# Altium schematic sheet Sheet1.SchDoc
size A4
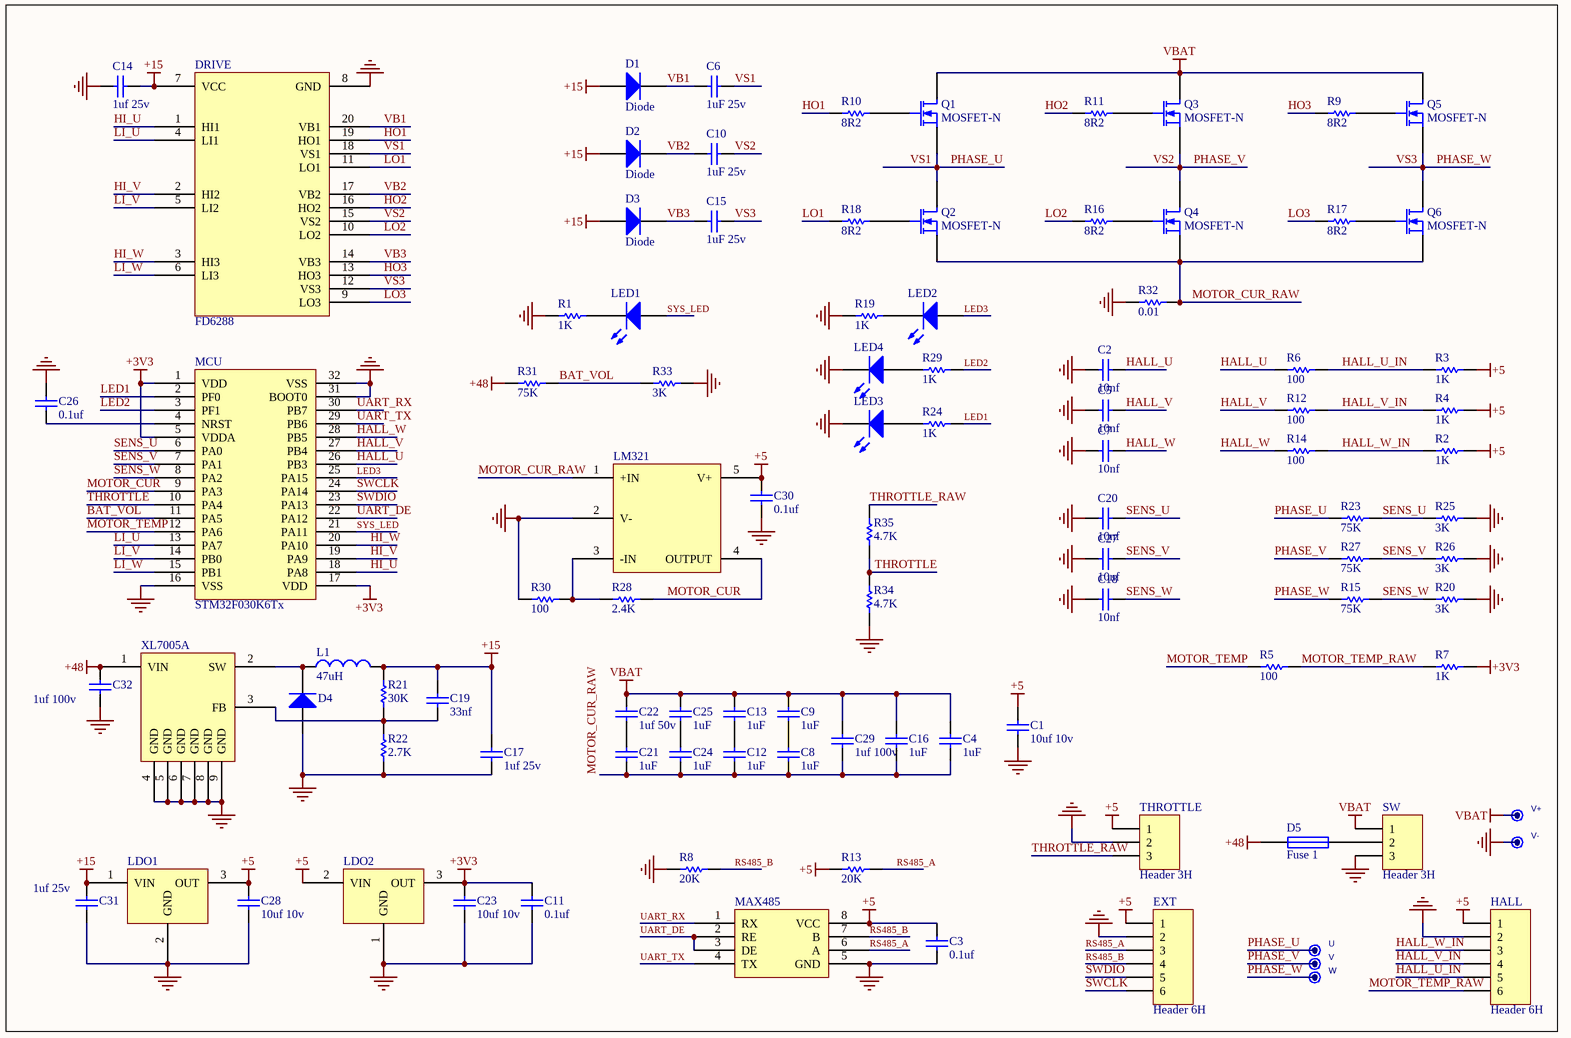
[diagram p0: Sheet1.SchDoc]

## Parts
C1  value 10uf 10v  [0603]  (hidden comment: Cap)
C2  value 10nf  [0603]  (hidden comment: Cap)
C3  value 0.1uf  [0603]  (hidden comment: Cap)
C4  value 1uF  [0603]  (hidden comment: Cap)
C5  value 10nf  [0603]  (hidden comment: Cap)
C6  value 1uF 25v  [0603]  (hidden comment: Cap)
C7  value 10nf  [0603]  (hidden comment: Cap)
C8  value 1uF  [1206]  (hidden comment: Cap)
C9  value 1uF  [1206]  (hidden comment: Cap)
C10  value 1uF 25v  [0603]  (hidden comment: Cap)
C11  value 0.1uf  [0603]  (hidden comment: Cap)
C12  value 1uF  [1206]  (hidden comment: Cap)
C13  value 1uF  [1206]  (hidden comment: Cap)
C14  value 1uf 25v  [0603]  (hidden comment: Cap)
C15  value 1uF 25v  [0603]  (hidden comment: Cap)
C16  value 1uF  [0603]  (hidden comment: Cap)
C17  value 1uf 25v  [0603]  (hidden comment: Cap)
C18  value 10nf  [0603]  (hidden comment: Cap)
C19  value 33nf  [0603]  (hidden comment: Cap)
C20  value 10nf  [0603]  (hidden comment: Cap)
C21  value 1uF  [1206]  (hidden comment: Cap)
C22  value 1uf 50v  [1206]  (hidden comment: Cap)
C23  value 10uf 10v  [0603]  (hidden comment: Cap)
C24  value 1uF  [1206]  (hidden comment: Cap)
C25  value 1uF  [1206]  (hidden comment: Cap)
C26  value 0.1uf  [0603]  (hidden comment: Cap)
C27  value 10nf  [0603]  (hidden comment: Cap)
C28  value 10uf 10v  [0603]  (hidden comment: Cap)
C29  value 1uf 100v  [0603]  (hidden comment: Cap)
C30  value 0.1uf  [0603]  (hidden comment: Cap)
C31  value 1uf 25v  [0603]  (hidden comment: Cap)
C32  value 1uf 100v  [1206]  (hidden comment: Cap)
D1  Diode  [0603]
D2  Diode  [0603]
D3  Diode  [0603]
D4  Diode  [1206]  (value not drawn)
D5  Fuse 1  [1206]
DRIVE  FD6288  [TSSOP20]
EXT  Header 6H  [HDR1X6H]
HALL  Header 6H  [HDR1X6H]
L1  value 47uH  [CDRH3D16]  (hidden comment: Inductor)
LDO1  78L05  [SOT-89]  (value not drawn)
LDO2  XC6206  [SOT23]  (value not drawn)
LED1  LED0  [0603]  (value not drawn)
LED2  LED0  [0603]  (value not drawn)
LED3  LED0  [0603]  (value not drawn)
LED4  LED0  [0603]  (value not drawn)
LM321  LM321  [SOT23-5]  (value not drawn)
MAX485  MAX485  [SOIC-8]  (value not drawn)
MCU  STM32F030K6Tx  [LQFP-32]
Q1  MOSFET-N  [TO220-MIX]
Q2  MOSFET-N  [TO220-MIX]
Q3  MOSFET-N  [TO220-MIX]
Q4  MOSFET-N  [TO220-MIX]
Q5  MOSFET-N  [TO220-MIX]
Q6  MOSFET-N  [TO220-MIX]
R1  value 1K  [0603]  (hidden comment: Res1)
R2  value 1K  [0603]  (hidden comment: Res1)
R3  value 1K  [0603]  (hidden comment: Res1)
R4  value 1K  [0603]  (hidden comment: Res1)
R5  value 100  [0603]  (hidden comment: Res1)
R6  value 100  [0603]  (hidden comment: Res1)
R7  value 1K  [0603]  (hidden comment: Res1)
R8  value 20K  [0603]  (hidden comment: Res1)
R9  value 8R2  [0603]  (hidden comment: Res1)
R10  value 8R2  [0603]  (hidden comment: Res1)
R11  value 8R2  [0603]  (hidden comment: Res1)
R12  value 100  [0603]  (hidden comment: Res1)
R13  value 20K  [0603]  (hidden comment: Res1)
R14  value 100  [0603]  (hidden comment: Res1)
R15  value 75K  [0603]  (hidden comment: Res1)
R16  value 8R2  [0603]  (hidden comment: Res1)
R17  value 8R2  [0603]  (hidden comment: Res1)
R18  value 8R2  [0603]  (hidden comment: Res1)
R19  value 1K  [0603]  (hidden comment: Res1)
R20  value 3K  [0603]  (hidden comment: Res1)
R21  value 30K  [0603]  (hidden comment: Res1)
R22  value 2.7K  [0603]  (hidden comment: Res1)
R23  value 75K  [0603]  (hidden comment: Res1)
R24  value 1K  [0603]  (hidden comment: Res1)
R25  value 3K  [0603]  (hidden comment: Res1)
R26  value 3K  [0603]  (hidden comment: Res1)
R27  value 75K  [0603]  (hidden comment: Res1)
R28  value 2.4K  [0603]  (hidden comment: Res1)
R29  value 1K  [0603]  (hidden comment: Res1)
R30  value 100  [0603]  (hidden comment: Res1)
R31  value 75K  [0603]  (hidden comment: Res1)
R32  value 0.01  [1206]  (hidden comment: Res1)
R33  value 3K  [0603]  (hidden comment: Res1)
R34  value 4.7K  [0603]  (hidden comment: Res1)
R35  value 4.7K  [0603]  (hidden comment: Res1)
SW  Header 3H  [HDR1X3H]
THROTTLE  Header 3H  [HDR1X3H]
U  TPS50mil  [PHASE]  (value not drawn)  (no BOM)
V  TPS50mil  [PHASE]  (value not drawn)  (no BOM)
V+  TPS50mil  [PHASE]  (value not drawn)  (no BOM)
V-  TPS50mil  [PHASE]  (value not drawn)  (no BOM)
W  TPS50mil  [PHASE]  (value not drawn)  (no BOM)
XL7005A  XL7005A  [SOIC-8P]  (value not drawn)

## Nets
+3V3: C11.1 C23.1 LDO2.3(OUT) MCU.1(VDD) MCU.5(VDDA) MCU.17(VDD) R7.1
+5: C1.1 C3.1 C28.1 C30.1 EXT.1 HALL.1 LDO1.3(OUT) LDO2.2(VIN) LM321.5(V+) MAX485.8(VCC) R2.1 R3.1 R4.1 R13.1 THROTTLE.1
+15: C14.2 C17.1 C19.1 C31.1 D1.1(A) D2.1(A) D3.1(A) DRIVE.7(VCC) L1.2 LDO1.1(VIN) R21.1
+48: C32.1 D5.1 R31.1 XL7005A.1(VIN)
GND: C1.2 C2.2 C3.2 C5.2 C7.2 C11.2 C14.1 C17.2 C18.1 C20.1 C23.2 C26.1 C27.1 C28.2 C30.2 C31.2 C32.2 D4.1(A) DRIVE.8(GND) EXT.2 HALL.2 LDO1.2(GND) LDO2.1(GND) LED3.2(K) LED4.2(K) LM321.2(V-) MAX485.5(GND) MCU.16(VSS) MCU.31(BOOT0) MCU.32(VSS) R1.2 R8.1 R19.2 R20.2 R22.2 R25.2 R26.2 R30.1 R32.2 R33.2 R34.2 SW.3 THROTTLE.2 V-.1 XL7005A.4(GND) XL7005A.5(GND) XL7005A.6(GND) XL7005A.7(GND) XL7005A.8(GND) XL7005A.9(GND)
VBAT: C4.1 C9.1 C13.1 C16.1 C22.1 C25.1 C29.1 Q1.1(D) Q3.1(D) Q5.1(D) SW.1 V+.1
BAT_VOL: MCU.11(PA5) R31.2 R33.1
HALL_U: C2.1 MCU.26(PB3) R6.2
HALL_U_IN: HALL.5 R3.2 R6.1
HALL_V: C5.1 MCU.27(PB4) R12.2
HALL_V_IN: HALL.4 R4.2 R12.1
HALL_W: C7.1 MCU.28(PB5) R14.2
HALL_W_IN: HALL.3 R2.2 R14.1
HI_U: DRIVE.1(HI1) MCU.18(PA8)
HI_V: DRIVE.2(HI2) MCU.19(PA9)
HI_W: DRIVE.3(HI3) MCU.20(PA10)
HO1: DRIVE.19(HO1) R10.2
HO2: DRIVE.16(HO2) R11.2
HO3: DRIVE.13(HO3) R9.2
LED1: MCU.2(PF0) R24.1
LED2: MCU.3(PF1) R29.1
LED3: LED2.1(A) MCU.25(PA15)
LI_U: DRIVE.4(LI1) MCU.13(PA7)
LI_V: DRIVE.5(LI2) MCU.14(PB0)
LI_W: DRIVE.6(LI3) MCU.15(PB1)
LO1: DRIVE.11(LO1) R18.2
LO2: DRIVE.10(LO2) R16.2
LO3: DRIVE.9(LO3) R17.2
MOTOR_CUR: LM321.4(OUTPUT) MCU.9(PA3) R28.2
MOTOR_CUR_RAW: C4.2 C8.2 C12.2 C16.2 C21.2 C24.2 C29.2 LM321.1(+IN) Q2.3(S) Q4.3(S) Q6.3(S) R32.1
MOTOR_TEMP: MCU.12(PA6) R5.2
MOTOR_TEMP_RAW: HALL.6 R5.1 R7.2
PHASE_U: C6.1 DRIVE.18(VS1) Q1.3(S) Q2.1(D) R23.1 U.1  [also labelled VS1]
PHASE_V: C10.1 DRIVE.15(VS2) Q3.3(S) Q4.1(D) R27.1 V.1  [also labelled VS2]
PHASE_W: C15.1 DRIVE.12(VS3) Q5.3(S) Q6.1(D) R15.1 W.1  [also labelled VS3]
RS485_A: EXT.3 MAX485.6(A) R13.2
RS485_B: EXT.4 MAX485.7(B) R8.2
SENS_U: C20.2 MCU.6(PA0) R23.2 R25.1
SENS_V: C27.2 MCU.7(PA1) R26.1 R27.2
SENS_W: C18.2 MCU.8(PA2) R15.2 R20.1
SWCLK: EXT.6 MCU.24(PA14)
SWDIO: EXT.5 MCU.23(PA13)
SYS_LED: LED1.1(A) MCU.21(PA11)
THROTTLE: MCU.10(PA4) R34.1 R35.2
THROTTLE_RAW: R35.1 THROTTLE.3
UART_DE: MAX485.2(RE) MAX485.3(DE) MCU.22(PA12)
UART_RX: MAX485.1(RX) MCU.30(PB7)
UART_TX: MAX485.4(TX) MCU.29(PB6)
VB1: C6.2 D1.2(K) DRIVE.20(VB1)
VB2: C10.2 D2.2(K) DRIVE.17(VB2)
VB3: C15.2 D3.2(K) DRIVE.14(VB3)
NetC8_1: C8.1 C9.2
NetC12_1: C12.1 C13.2
NetC19_2: C19.2 R21.2 R22.1 XL7005A.3(FB)
NetC21_1: C21.1 C22.2
NetC24_1: C24.1 C25.2
NetC26_2: C26.2 MCU.4(NRST)
NetD4_2: D4.2(K) L1.1 XL7005A.2(SW)
NetD5_2: D5.2 SW.2
NetLED1_2: LED1.2(K) R1.1
NetLED2_2: LED2.2(K) R19.1
NetLED3_1: LED3.1(A) R24.2
NetLED4_1: LED4.1(A) R29.2
NetLM321_3: LM321.3(-IN) R28.1 R30.2
NetQ1_2: Q1.2(G) R10.1
NetQ2_2: Q2.2(G) R18.1
NetQ3_2: Q3.2(G) R11.1
NetQ4_2: Q4.2(G) R16.1
NetQ5_2: Q5.2(G) R9.1
NetQ6_2: Q6.2(G) R17.1

## Library data of the parts
C1-C32 = Cap: Capacitor; Published: 8-Jun-2000; LatestRevisionDate: 17-Jul-2002; LatestRevisionNote: Re-released for DXP Platform.; PackageReference: RAD-0.3; Publisher: Altium Limited; PackageDescription: Radial Cap, Thru-Hole; 2 Leads; 0.3 in Pin Spacing
D1-D4 = Diode: Default Diode; Published: 8-Jun-2000; LatestRevisionDate: 17-Jul-2002; LatestRevisionNote: Re-released for DXP Platform.; PackageVersion: Sep-1996; PackageReference: SMC; Publisher: Altium Limited; PackageDescription: DO-214-AB/SMC; 2 C-Bend Leads; Body 7.9 x 5.9 mm, inc. leads (LxW); Code_JEDEC: DO-214-AB
D5 = Fuse 1: Fuse; Published: 8-Jun-2000; LatestRevisionDate: 17-Jul-2002; LatestRevisionNote: Re-released for DXP Platform.; PackageReference: PIN-W2/E2.8; Publisher: Altium Limited; PackageDescription: Thru-Hole; 2 Leads
EXT HALL = Header 6H: Header, 6-Pin, Right Angle; LatestRevisionDate: 17-Jul-2002; LatestRevisionNote: Re-released for DXP Platform.; Publisher: Altium Limited
L1 = Inductor: Code_IEC: 1005; Published: 8-Jun-2000; LatestRevisionDate: 29-May-2009; LatestRevisionNote: IPC-7351 Footprint Added.; PackageReference: 0402-A; Publisher: Altium Limited; PackageDescription: Chip Inductor; Code_JEITA: 0402
LDO2 = HT75xx
LED1-LED4 = LED0: Typical INFRARED GaAs LED; Published: 8-Jun-2000; LatestRevisionDate: 08-Jul-2005; LatestRevisionNote: Mech Layer 1 removed.; PackageReference: LED-0; Publisher: Altium Limited; PackageDescription: LED; 2 Leads
MAX485 = SP3485
Q1-Q6 = MOSFET-N: N-Channel MOSFET; pin to pad: 1>2 2>1; Published: 8-Jun-2000; LatestRevisionDate: 17-Jul-2002; LatestRevisionNote: Re-released for DXP Platform.; PackageVersion: 1995/1996; PackageReference: E3; Publisher: Altium Limited; PackageDescription: TO, Flat Index; 3 In-Line, Axial Leads; Body Dia. 4.6mm; Lead Dia. 0.5 mm (max)
R1-R35 = Res1: Resistor; Published: 8-Jun-2000; LatestRevisionDate: 17-Jul-2002; LatestRevisionNote: Re-released for DXP Platform.; PackageReference: AXIAL-0.3; Publisher: Altium Limited; PackageDescription: Axial Device, Thru-Hole; 2 Leads; 0.3 in Pin Spacing
SW THROTTLE = Header 3H: Header, 3-Pin, Right Angle; LatestRevisionDate: 17-Jul-2002; LatestRevisionNote: Re-released for DXP Platform.; Publisher: Altium Limited
U V V+ V- W = TPS50mil: Test Point, 12x25mil, Not Populated